# Altium schematic sheet NBIOT.SchDoc: TLS RASTRO - 01_MCU
size A2; DrawnBy: AP; Revision: 1.0; SheetNumber: 2; SheetTotal: 5
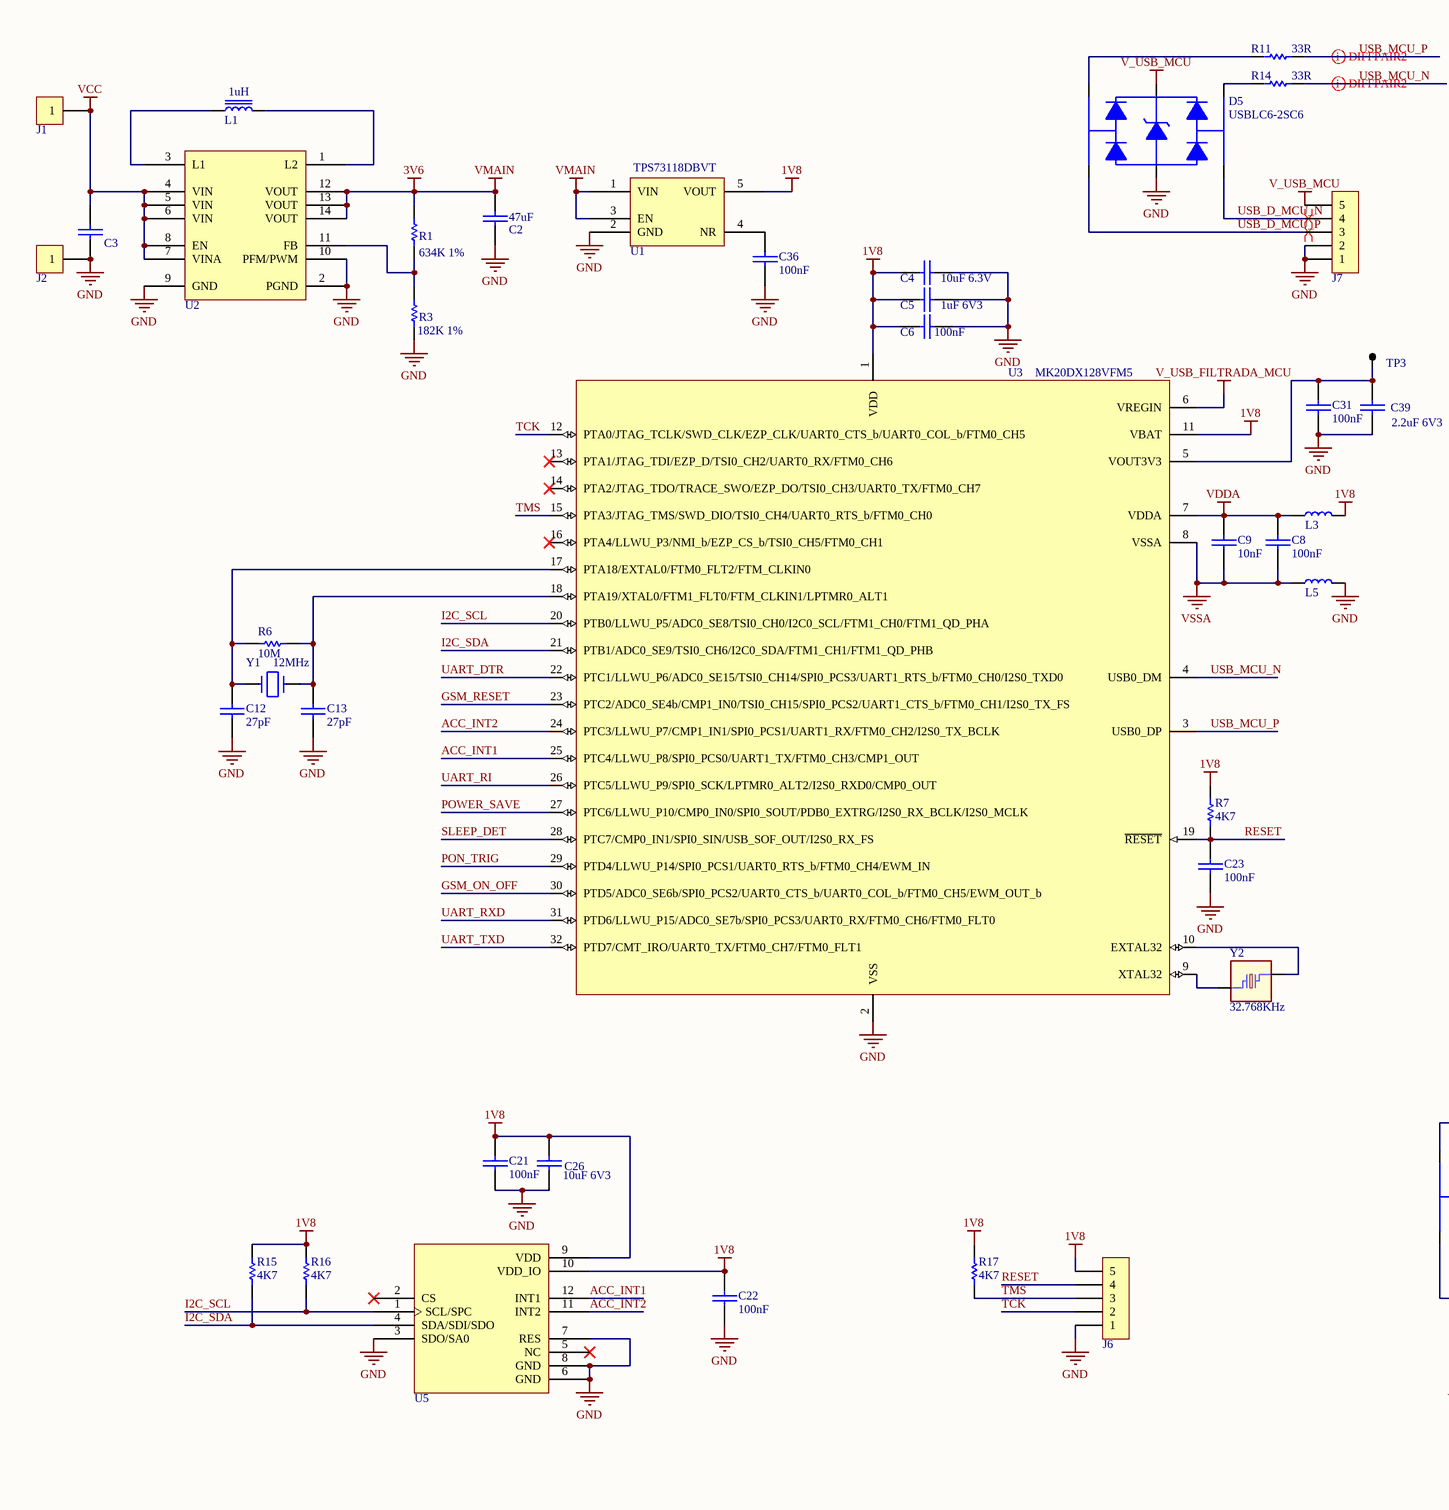
[diagram p0: NBIOT.SchDoc, left]
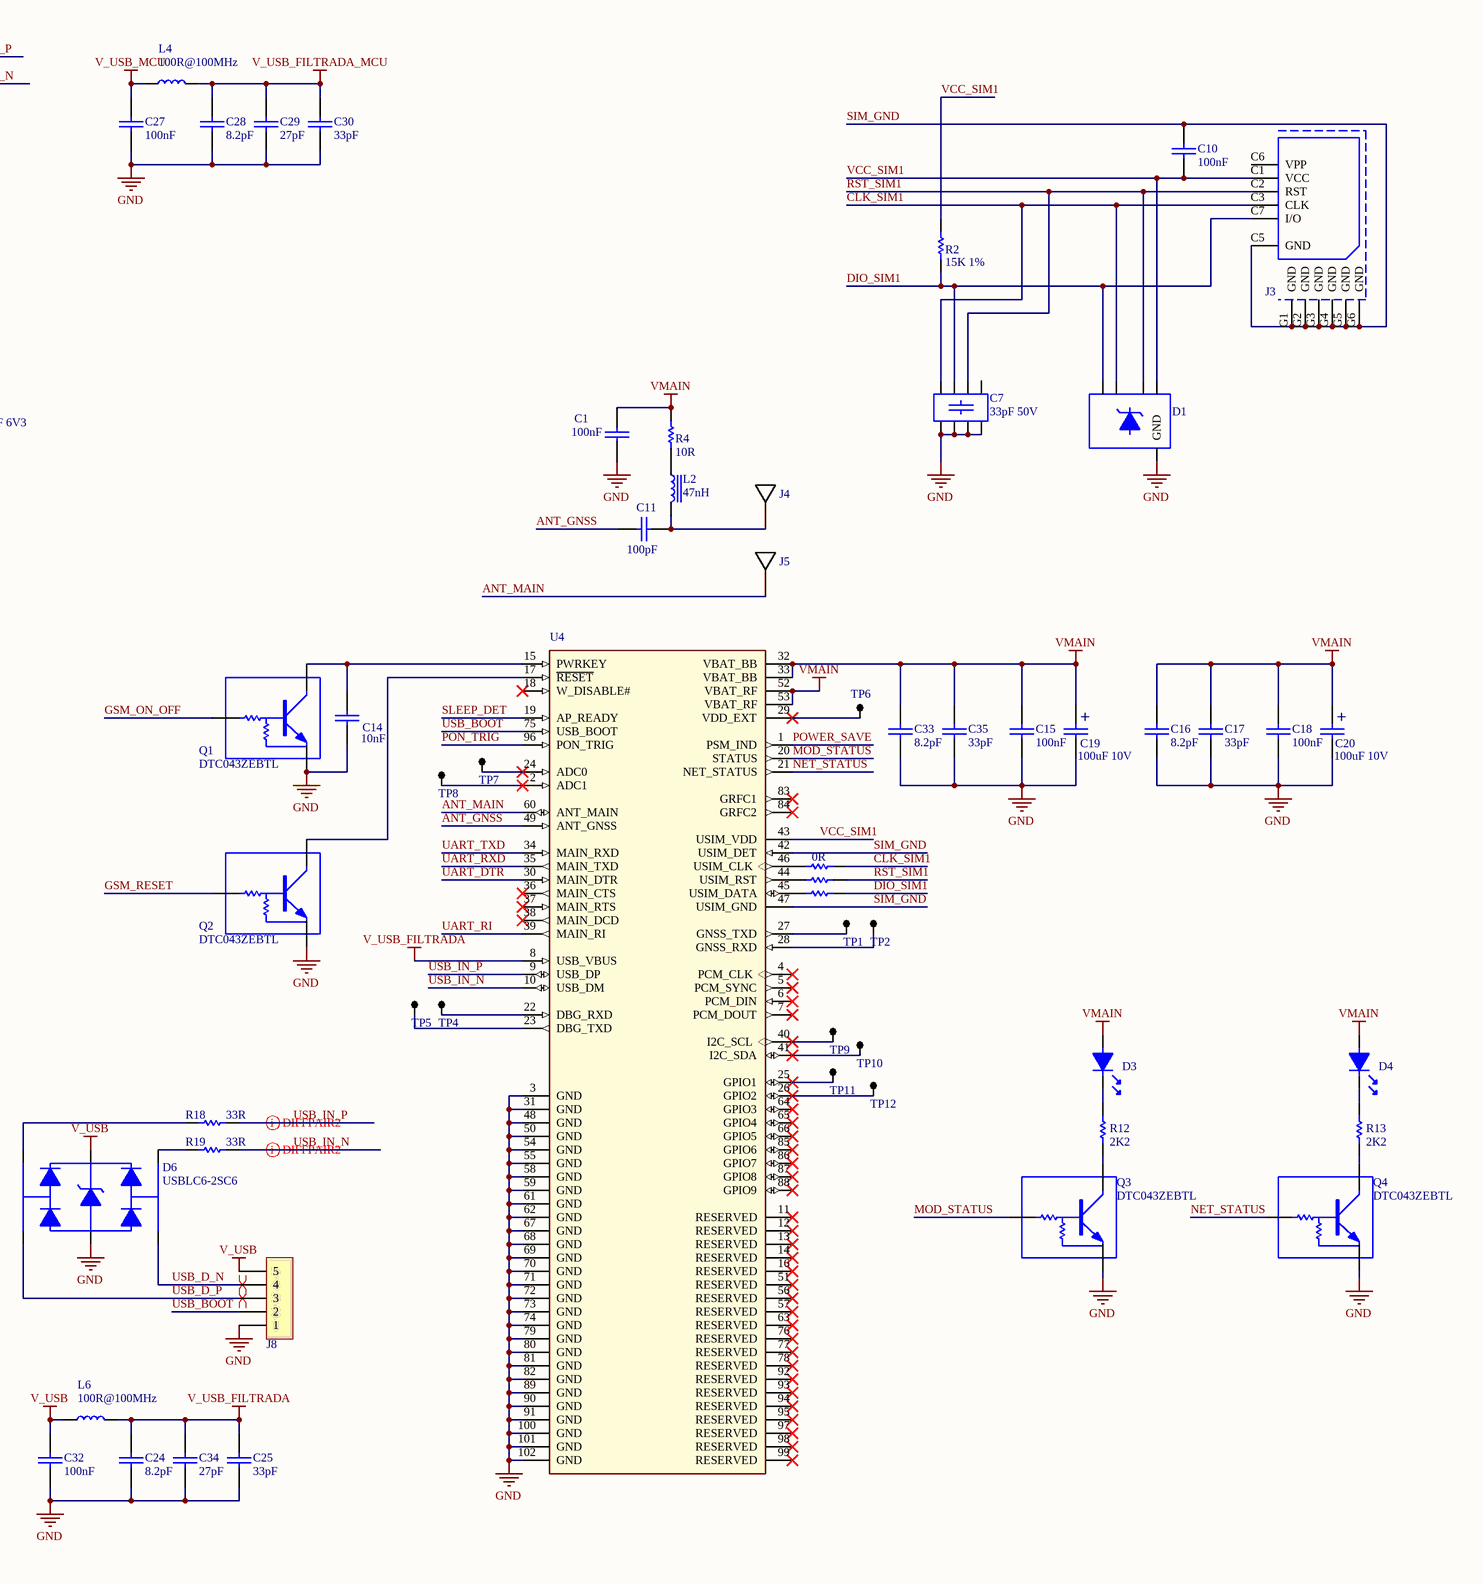
[diagram p1: NBIOT.SchDoc, right]

## Parts
C1  100nF  [0402]
C2  47uF  [0603]
C3  10uF 6V3  [0603]  (value not drawn)
C4  10uF 6.3V  [0603]
C5  1uF 6V3  [0402]
C6  100nF  [0402]
C7  33pF 50V  [CKCL44]
C8  100nF  [0402]
C9  10nF  [0402]
C10  100nF  [0402]
C11  100pF  [0402]
C12  27pF  [0402]
C13  27pF  [0402]
C14  10nF  [0402]
C15  100nF  [0402]
C16  8.2pF  [0402]
C17  33pF  [0402]
C18  100nF  [0402]
C19  100uF 10V  [1210P]
C20  100uF 10V  [1210P]
C21  100nF  [0402]
C22  100nF  [0402]
C23  100nF  [0402]
C24  8.2pF  [0402]
C25  33pF  [0402]
C26  10uF 6V3  [0603]
C27  100nF  [0402]
C28  8.2pF  [0402]
C29  27pF  [0402]
C30  33pF  [0402]
C31  100nF  [0402]
C32  100nF  [0402]
C33  8.2pF  [0402]
C34  27pF  [0402]
C35  33pF  [0402]
C36  100nF  [0402]
C39  2.2uF 6V3  [0402]
D1  SP1001-04  [SOT553]  (value not drawn)
D3  ROJO  [LED0805_R]  (value not drawn)
D4  ROJO  [LED0805_R]  (value not drawn)
D5  USBLC6-2SC6  [SOT23-6]
D6  USBLC6-2SC6  [SOT23-6]
J1  PIN CABLE  [PIN_CABLE]  (value not drawn)
J2  PIN CABLE  [PIN_CABLE]  (value not drawn)
J3  MOLEX 0786463001  [MOLEX_uSIM_0786463001]  (value not drawn)
J4  1566230-1  [Style A - 1566230]  (value not drawn)
J5  1566230-1  [Style A - 1566230]  (value not drawn)
J6  2111-1X5G00SB  [SIP5_MM]  (value not drawn)
J7  2111-1X5G00SB  [SIP5_MM]  (value not drawn)
J8  2111-1X5G00SB  [SIP5_MM]  (value not drawn)
L1  1uH  [XGL4020102]
L2  47nH  [0402]
L3  100R@100MHz  [0603]  (value not drawn)
L4  100R@100MHz  [0603]
L5  100R@100MHz  [0603]  (value not drawn)
L6  100R@100MHz  [0603]
Q1  DTC043ZEBTL  [SOT723]
Q2  DTC043ZEBTL  [SOT723]
Q3  DTC043ZEBTL  [SOT723]
Q4  DTC043ZEBTL  [SOT723]
R1  634K 1%  [0402]
R2  15K 1%  [0402]
R3  182K 1%  [0402]
R4  10R  [0402]
R6  10M  [0402]
R7  4K7  [0402]
R8  0R  [0402]
R9  0R  [0402]  (value not drawn)
R10  0R  [0402]  (value not drawn)
R11  33R  [0402]
R12  2K2  [0402]
R13  2K2  [0402]
R14  33R  [0402]
R15  4K7  [0402]
R16  4K7  [0402]
R17  4K7  [0402]
R18  33R  [0402]
R19  33R  [0402]
TP1  TP  [TP]  (value not drawn)
TP2  TP  [TP]  (value not drawn)
TP3  TP  [TP]  (value not drawn)
TP4  TP  [TP]  (value not drawn)
TP5  TP  [TP]  (value not drawn)
TP6  TP  [TP]  (value not drawn)
TP7  TP  [TP]  (value not drawn)
TP8  TP  [TP]  (value not drawn)
TP9  TP  [TP]  (value not drawn)
TP10  TP  [TP]  (value not drawn)
TP11  TP  [TP]  (value not drawn)
TP12  TP  [TP]  (value not drawn)
U1  TPS73118DBVT  [SOT23-5]
U2  TPS63025  [VQFN14]  (value not drawn)
U3  MK20DX128VFM5  [QFN32EP]
U4  BG95  [BG95]  (value not drawn)
U5  LIS2DS12  [LGA12]  (value not drawn)
Y1  12MHz  [NX3225SA]
Y2  32.768KHz  [ECS-1210]

## Nets
1V8: C4.1 C5.1 C6.1 C21.1 C22.1 C26.1 J6.5 L3.2 R7.2 R15.2 R16.2 R17.2 U1.5(VOUT) U3.1(VDD) U3.11(VBAT) U5.9(VDD) U5.10(VDD_IO)
3V6: C1.1 C2.1 C15.1 C16.1 C17.1 C18.1 C19.1 C20.1 C33.1 C35.1 D3.1 D4.1 R1.2 R4.2 U1.1(VIN) U1.3(EN) U2.12(VOUT) U2.13(VOUT) U2.14(VOUT) U4.32(VBAT_BB) U4.33(VBAT_BB) U4.52(VBAT_RF) U4.53(VBAT_RF)  [also labelled VMAIN]
GND: C1.2 C2.2 C3.2 C4.2 C5.2 C6.2 C7.1 C7.2 C7.3 C7.4 C12.2 C13.2 C14.2 C15.2 C16.2 C17.2 C18.2 C19.2 C20.2 C21.2 C22.2 C23.1 C24.2 C25.2 C26.2 C27.2 C28.2 C29.2 C30.2 C31.1 C32.2 C33.2 C34.2 C35.2 C36.1 C39.2 D1.2(GND) D5.2 D6.2 J2.1 J4.2 J4.3 J5.2 J5.3 J6.1 J7.1 J7.2 J8.1 L5.2 Q1.3(E) Q2.3(E) Q3.3(E) Q4.3(E) R3.1 U1.2(GND) U2.2(PGND) U2.9(GND) U2.10(PFM/PWM) U3.2(VSS) U4.3(GND) U4.31(GND) U4.48(GND) U4.50(GND) U4.54(GND) U4.55(GND) U4.58(GND) U4.59(GND) U4.61(GND) U4.62(GND) U4.67(GND) U4.68(GND) U4.69(GND) U4.70(GND) U4.71(GND) U4.72(GND) U4.73(GND) U4.74(GND) U4.79(GND) U4.80(GND) U4.81(GND) U4.82(GND) U4.89(GND) U4.90(GND) U4.91(GND) U4.100(GND) U4.101(GND) U4.102(GND) U5.3(SDO/SA0) U5.6(GND) U5.7(RES) U5.8(GND) Y1.2 Y1.4
V_USB: C32.1 D6.5 J8.5 L6.1
V_USB_FILTRADA: C24.1 C25.1 C34.1 L6.2 U4.8(USB_VBUS)
V_USB_FILTRADA_MCU: C28.1 C29.1 C30.1 L4.2 U3.6(VREGIN)
V_USB_MCU: C27.1 D5.5 J7.5 L4.1
VCC: C3.1 J1.1 U2.4(VIN) U2.5(VIN) U2.6(VIN) U2.7(VINA) U2.8(EN)
VDDA: C8.1 C9.1 L3.1 U3.7(VDDA)
VSSA: C8.2 C9.2 L5.1 U3.8(VSSA)
ACC_INT1: U3.25(PTC4/LLWU_P8/SPI0_PCS0/UART1_TX/FTM0_CH3/CMP1_OUT) U5.12(INT1)
ACC_INT2: U3.24(PTC3/LLWU_P7/CMP1_IN1/SPI0_PCS1/UART1_RX/FTM0_CH2/I2S0_TX_BCLK) U5.11(INT2)
ANT_GNSS: C11.1 U4.49(ANT_GNSS)
ANT_MAIN: J5.1 U4.60(ANT_MAIN)
CLK_SIM1: C7.5 D1.3 J3.C3(CLK) R8.2
DIO_SIM1: C7.6 D1.1 J3.C7(I/O) R2.1 R10.2
GSM_ON_OFF: Q1.1(B) U3.30(PTD5/ADC0_SE6b/SPI0_PCS2/UART0_CTS_b/UART0_COL_b/FTM0_CH5/EWM_OUT_b)
GSM_RESET: Q2.1(B) U3.23(PTC2/ADC0_SE4b/CMP1_IN0/TSI0_CH15/SPI0_PCS2/UART1_CTS_b/FTM0_CH1/I2S0_TX_FS)
I2C_SCL: R16.1 U3.20(PTB0/LLWU_P5/ADC0_SE8/TSI0_CH0/I2C0_SCL/FTM1_CH0/FTM1_QD_PHA) U5.1(SCL/SPC)
I2C_SDA: R15.1 U3.21(PTB1/ADC0_SE9/TSI0_CH6/I2C0_SDA/FTM1_CH1/FTM1_QD_PHB) U5.4(SDA/SDI/SDO)
MOD_STATUS: Q3.1(B) U4.20(STATUS)
NET_STATUS: Q4.1(B) U4.21(NET_STATUS)
PON_TRIG: U3.29(PTD4/LLWU_P14/SPI0_PCS1/UART0_RTS_b/FTM0_CH4/EWM_IN) U4.96(PON_TRIG)
POWER_SAVE: U3.27(PTC6/LLWU_P10/CMP0_IN0/SPI0_SOUT/PDB0_EXTRG/I2S0_RX_BCLK/I2S0_MCLK) U4.1(PSM_IND)
RESET: C23.2 J6.4 R7.1 U3.19(~{RESET})
RST_SIM1: C7.7 D1.4 J3.C2(RST) R9.2
SIM_GND: C10.1 J3.C5(GND) J3.G1(GND) J3.G2(GND) J3.G3(GND) J3.G4(GND) J3.G5(GND) J3.G6(GND) U4.42(USIM_DET) U4.47(USIM_GND)
SLEEP_DET: U3.28(PTC7/CMP0_IN1/SPI0_SIN/USB_SOF_OUT/I2S0_RX_FS) U4.19(AP_READY)
TCK: J6.2 U3.12(PTA0/JTAG_TCLK/SWD_CLK/EZP_CLK/UART0_CTS_b/UART0_COL_b/FTM0_CH5)
TMS: J6.3 R17.1 U3.15(PTA3/JTAG_TMS/SWD_DIO/TSI0_CH4/UART0_RTS_b/FTM0_CH0)
UART_DTR: U3.22(PTC1/LLWU_P6/ADC0_SE15/TSI0_CH14/SPI0_PCS3/UART1_RTS_b/FTM0_CH0/I2S0_TXD0) U4.30(MAIN_DTR)
UART_RI: U3.26(PTC5/LLWU_P9/SPI0_SCK/LPTMR0_ALT2/I2S0_RXD0/CMP0_OUT) U4.39(MAIN_RI)
UART_RXD: U3.31(PTD6/LLWU_P15/ADC0_SE7b/SPI0_PCS3/UART0_RX/FTM0_CH6/FTM0_FLT0) U4.35(MAIN_TXD)
UART_TXD: U3.32(PTD7/CMT_IRO/UART0_TX/FTM0_CH7/FTM0_FLT1) U4.34(MAIN_RXD)
USB_BOOT: J8.2 U4.75(USB_BOOT)
USB_D_MCU_N: D5.3 J7.4
USB_D_MCU_P: D5.1 J7.3
USB_D_N: D6.3 J8.4
USB_D_P: D6.1 J8.3
USB_IN_N: R19.2 U4.10(USB_DM)
USB_IN_P: R18.2 U4.9(USB_DP)
USB_MCU_N: R14.2 U3.4(USB0_DM)
USB_MCU_P: R11.2 U3.3(USB0_DP)
VCC_SIM1: C10.2 D1.5 J3.C1(VCC) R2.2 U4.43(USIM_VDD)
NetC11_2: C11.2 J4.1 L2.2
NetC12_1: C12.1 R6.1 U3.17(PTA18/EXTAL0/FTM0_FLT2/FTM_CLKIN0) Y1.1
NetC13_1: C13.1 R6.2 U3.18(PTA19/XTAL0/FTM1_FLT0/FTM_CLKIN1/LPTMR0_ALT1) Y1.3
NetC14_1: C14.1 Q1.2(C) U4.15(PWRKEY)
NetC31_2: C31.2 C39.1 TP3.1 U3.5(VOUT3V3)
NetC36_2: C36.2 U1.4(NR)
NetD3_2: D3.2 R12.2
NetD4_2: D4.2 R13.2
NetD5_4: D5.4 R14.1
NetD5_6: D5.6 R11.1
NetD6_4: D6.4 R19.1
NetD6_6: D6.6 R18.1
NetL1_1: L1.1 U2.3(L1)
NetL1_2: L1.2 U2.1(L2)
NetL2_1: L2.1 R4.1
NetQ2_2: Q2.2(C) U4.17(~{RESET})
NetQ3_2: Q3.2(C) R12.1
NetQ4_2: Q4.2(C) R13.1
NetR1_1: R1.1 R3.2 U2.11(FB)
NetR8_1: R8.1 U4.46(USIM_CLK)
NetR9_1: R9.1 U4.44(USIM_RST)
NetR10_1: R10.1 U4.45(USIM_DATA)
NetTP1_1: TP1.1 U4.27(GNSS_TXD)
NetTP2_1: TP2.1 U4.28(GNSS_RXD)
NetTP4_1: TP4.1 U4.22(DBG_RXD)
NetTP5_1: TP5.1 U4.23(DBG_TXD)
NetTP6_1: TP6.1 U4.29(VDD_EXT)
NetTP7_1: TP7.1 U4.24(ADC0)
NetTP8_1: TP8.1 U4.2(ADC1)
NetTP9_1: TP9.1 U4.40(I2C_SCL)
NetTP10_1: TP10.1 U4.41(I2C_SDA)
NetTP11_1: TP11.1 U4.25(GPIO1)
NetTP12_1: TP12.1 U4.26(GPIO2)
NetU3_9: U3.9(XTAL32) Y2.2
NetU3_10: U3.10(EXTAL32) Y2.1

Not connected (* = marked no-connect by the designer): C7 8; J3 C6(VPP); U3 13(PTA1/JTAG_TDI/EZP_D/TSI0_CH2/UART0_RX/FTM0_CH6)* 14(PTA2/JTAG_TDO/TRACE_SWO/EZP_DO/TSI0_CH3/UART0_TX/FTM0_CH7)* 16(PTA4/LLWU_P3/NMI_b/EZP_CS_b/TSI0_CH5/FTM0_CH1)*; U4 4(PCM_CLK)* 5(PCM_SYNC)* 6(PCM_DIN)* 7(PCM_DOUT)* 11(RESERVED)* 12(RESERVED)* 13(RESERVED)* 14(RESERVED)* 16(RESERVED)* 18(W_DISABLE#)* 36(MAIN_CTS)* 37(MAIN_RTS)* 38(MAIN_DCD)* 51(RESERVED)* 56(RESERVED)* 57(RESERVED)* 63(RESERVED)* 64(GPIO3)* 65(GPIO4)* 66(GPIO5)* 76(RESERVED)* 77(RESERVED)* 78(RESERVED)* 83(GRFC1)* 84(GRFC2)* 85(GPIO6)* 86(GPIO7)* 87(GPIO8)* 88(GPIO9)* 92(RESERVED)* 93(RESERVED)* 94(RESERVED)* 95(RESERVED)* 97(RESERVED)* 98(RESERVED)* 99(RESERVED)*; U5 2(CS)* 5(NC)*

## Layout directives
differential pair: USB_D_MCU_N, USB_D_MCU_P, USB_D_N, USB_D_P, USB_IN_N, USB_IN_P, USB_MCU_N, USB_MCU_P

## Notes on the sheet
- (in symbol CAP_TAN_100uF_10V_1210) +

## Library data of the parts
C1 = CAP0402_100nF_50V_X7R: CAP0402 100nF 50V X7R; Manufacturer: TDK Corporation; Manufacturer Part Number: C1005X7R1H104K050BB; CREO: LL; Part Number: CAP0402_100nF_50V_X7R; Value: 100nF; Supplier 1: Digi-Key; Supplier Part Number 1: 445-5932-2-ND
C2 = CAP0603_47uF_X5R: CAP0603 47uF 6.3V; Manufacturer: Murata Electronics; Manufacturer Part Number: GRM188R60J476ME15D; CREO: JP; Part Number: CAP0603_47uF_X5R; Value: 47uF; Supplier 1: Digi-Key; Supplier Part Number 1: 490-13247-1-ND
C3 C26 = CAP0603_10uF_6V3_X5R: CAP0603 10uF 6V3 X5R; Manufacturer: Murata Electronics; Manufacturer Part Number: GRM188R60J106KE47D; CREO: JP; Part Number: CAP0603_10uF_6V3_X5R; Value: 10uF 6V3; Supplier 1: Digi-Key; Supplier Part Number 1: 490-12538-1-ND
C4 = CAP0603_10uF_6.3V_Y5V: CAP0603 10uF 6.3V Y5V; Manufacturer: TDK Corporation; Manufacturer Part Number: C1608Y5V0J106Z; CREO: EB; Precio: 0; Part Number: CAP0603_10uF_6.3V_Y5V; Value: 10uF 6.3V; Digikey PN: 445-3448-1-ND; Supplier 1: Digi-Key; Supplier Part Number 1: 445-3448-1-ND
C5 = CAP0402_1uF_6V3_X5R: CAP0402 1uF 6V3 X5R; CREO: EB; Precio: 0; Part Number: CAP0402_1uF_6V3_X5R; Value: 1uF 6V3; Digikey PN: 445-4998-1-ND; Supplier 1: Digi-Key; Supplier Part Number 1: 445-4998-1-ND
C6 C8 C10 C15 C18 C21-C23 C31 C36 = CAP0402_100nF_50V_X7R: CAP0402 100nF 50V X7R; Manufacturer: TDK Corporation; Manufacturer Part Number: C1005X7R1H104K050BB; CREO: LL; Precio: 0; Part Number: CAP0402_100nF_50V_X7R; Value: 100nF; Digikey PN: 445-5932-2-ND; Supplier 1: Digi-Key; Supplier Part Number 1: 445-5932-2-ND
C7 = CAPARRAY0805_4_33pF_50V_NP0: CAP ARRAY 4CH 33PF 50V 0805; CREO: EB; Precio: 0; Part Number: CAPARRAY0805_4_33pF_50V_NP0; Value: 33pF 50V; Digikey PN: 445-1825-1-ND
C9 = CAP0402_10nF_X7R: CAP0402 10nF 50V X7R; Manufacturer: TDK Corporation; Manufacturer Part Number: C1005X7R1H103K050BB; CREO: EB; Precio: 0; Part Number: CAP0402_10nF_X7R; Value: 10nF; Digikey PN: 445-6850-2-ND; Supplier 1: Digi-Key; Supplier Part Number 1: 445-6850-2-ND
C11 = CAP0402_100pF_50V_5%_NP0: CAP0402 100PF 50V 5% NP0; CREO: EB; Part Number: CAP0402_100pF_50V_5%_NP0; Value: 100pF; Supplier 1: Digi-Key; Supplier Part Number 1: 445-8869-2-ND
C12 C13 C29 C34 = CAP0402_27pF_NP0: CAP0402 27pF 50V NP0; CREO: EB; Precio: 0; Part Number: CAP0402_27pF_NP0; Value: 27pF; Digikey PN: 311-1019-2-ND
  C12 C13: Supplier 1: Digi-Key; Supplier Part Number 1: 311-1019-2-ND
C14 = CAP0402_10nF_X7R: CAP0402 10nF 50V X7R; Manufacturer: TDK Corporation; Manufacturer Part Number: C1005X7R1H103K050BB; CREO: EB; Part Number: CAP0402_10nF_X7R; Value: 10nF; Supplier 1: Digi-Key; Supplier Part Number 1: 445-6850-2-ND
C16 C24 C28 C33 = CAP0402_8.2pF_NP0: CAP0402 8.2pF 50V NP0; CREO: EB; Precio: 0; Part Number: CAP0402_8.2pF_NP0; Value: 8.2pF; Digikey PN: 311-1012-2-ND
C17 C25 C30 C35 = CAP0402_33pF_NP0: CAP CER 33PF 50V 5% NP0 0402; Manufacturer: Murata; Manufacturer #: GRM1555C1H330JA01D; CREO: EB; Precio: 0; Part Number: CAP0402_33pF_NP0; Value: 33pF; Digikey PN: 490-5936-2-ND
C19 C20 = CAP_TAN_100uF_10V_1210: CAP TANT 100UF 10V 20% 1210; CREO: EB; Part Number: CAP_TAN_100uF_10V_1210; Value: 100uF 10V; Supplier 1: Digi-Key; Supplier Part Number 1: 718-1761-1-ND; APROBO: -
C27 C32 = CAP0402_100nF_50V_X7R: CAP0402 100nF 50V X7R; CREO: LL; Precio: 0; Part Number: CAP0402_100nF_50V_X7R; Value: 100nF; Digikey PN: 445-5932-2-ND
C39 = CAP0402_2.2uF_6V3_X5R: CAP0402 2.2uF 6V3 X5R; Manufacturer: TDK Corporation; Manufacturer Part Number: C1005X5R0J225M050BC; CREO: EB; Part Number: CAP0402_2.2uF_6V3_X5R; Value: 2.2uF 6V3; Supplier 1: Digi-Key; Supplier Part Number 1: 445-4999-2-ND
D1 = SP1001-04: TVS DIODE 5.5V 13V SOT553; Manufacturer: Littelfuse Inc.; Manufacturer Part Number: SP1001-04XTG; CREO: MM; Part Number: SP1001-04; Value: SP1001-04; Supplier 1: Digi-Key; Supplier Part Number 1: F2896CT-ND
D3 D4 = LED0805_ROJO_30MA: LED SUPER RED CLR THIN 0805 SMD; Manufacturer: Lite-On Inc; Manufacturer Part Number: LTST-C171KRKT; CREO: JS; Part Number: LED0805_ROJO_30MA; Value: ROJO; Supplier 1: Digi-Key; Supplier Part Number 1: 160-1427-2-ND
D5 D6 = USBLC6-2_SOT23-6: VERY LOW CAPACITANCE ESD 2 LINES PROTECTION; CREO: EB; Precio: 0; Part Number: USBLC6-2_SOT23-6; Value: USBLC6-2SC6; Digikey PN: 497-5235-2-ND
J1 J2 = PIN_1_CABLE_1mm: PIN PARA SOLDAR CABLE 1MM; Publico: EB; Part Number: PIN_1_CABLE_1mm; Value: PIN CABLE; Aprobo: -
J3 = MOLEX_uSIM_0786463001: 1.45mm Height Push-Pull micro-SIM Card Socket without Detect Switch; Publico: EB; Part Number: MOLEX_uSIM_0786463001; Value: MOLEX 0786463001; Supplier 1: Digi-Key; Supplier Part Number 1: WM9364TR-ND; Aprobo: -
J4 J5 = UMCC_1566230_A: CONN UMCC RCPT SMD STYLE A FOR TYPE-II/III; Publico: EB; Part Number: UMCC_1566230_A; Value: 1566230-1; Supplier 1: Digi-Key; Supplier Part Number 1: A36237CT-ND; Aprobo: -
J6 = HEADER_5POS_2MM: PIN HEADER 2.00mm 5POS; Manufacturer: Harwin; Manufacturer Part Number: M22-2510505; Publico: EB; Part Number: HEADER_5POS_2MM; Value: 2111-1X5G00SB; Supplier 1: Digi-Key; Supplier Part Number 1: 952-1314-ND; Aprobo: -
J7 J8 = HEADER_5POS_2MM: PIN HEADER 2.00mm 5POS; Publico: EB; Part Number: HEADER_5POS_2MM; Value: 2111-1X5G00SB; Supplier 1: OUPIIN; Aprobo: -
L1 = IND_PWR_1uH_DR: INDUCTOR SHIELD PWR 1UH SMD; Manufacturer: COILCRAFT; Manufacturer Part Number: XGL4020-102MEC; Publico: JP; Part Number: IND_PWR_1uH_DR; Value: 1uH; Supplier 1: Digi-Key; Supplier Part Number 1: 2457-XGL4020-102MEC-ND; Aprobo: -
L2 = IND0402_47nH: FIXED IND 47NH 440MA 648 MOHM; Manufacturer: Murata; Manufacturer Part Number: LQW15AN47NG80D; Publico: LB; Part Number: IND0402_47nH; Value: 47nH; Supplier 1: Digi-Key; Supplier Part Number 1: 490-7644-1-ND; Aprobo: -
L3 L5 = IND0603_100@100MHz: FERRITE CHIP 100 OHM 1A 0603; Publico: EB; Part Number: IND0603_100@100MHz; Value: 100R@100MHz; Supplier 1: Digi-Key; Supplier Part Number 1: 445-2988-1-ND; Aprobo: -
L4 L6 = IND0603_100_2A@100MHz: FERRITE CHIP 100 OHM 2A 0603; Manufacturer: Murata; Manufacturer #: BLM18EG101TN1D; Publico: EB; Precio: 0; Part Number: IND0603_100_2A@100MHz; Value: 100R@100MHz; Digikey PN: 490-5978-1-ND; Aprobo: -
Q1-Q4 = DTC043ZEBTL_SOT723: TRANS PREBIAS NPN 50V EMT3F; Manufacturer: Rohm Semiconductor; Publico: LB; Part Number: DTC043ZEBTL_SOT723; Value: DTC043ZEBTL; Manufacturer Part Number: DTC043ZEBTL; Supplier 1: Digi-Key; Supplier Part Number 1: DTC043ZEBTLCT-ND; Aprobo: -
R1 = RES0402_634K_1%: RES0402 634K 1%; Manufacturer: Stackpole Electronics Inc; Manufacturer Part Number: RMCF0402FT634K; Publico: JP; Part Number: RES0402_634K_1%; Value: 634K 1%; Supplier 1: Digi-Key; Supplier Part Number 1: RMCF0402FT634KCT-ND; Aprobo: -
R2 = RES0402_15K_1%: RES0402 15K 1%; Publico: EB; Part Number: RES0402_15K_1%; Value: 15K 1%; Supplier 1: Digi-Key; Supplier Part Number 1: RMCF0402FT15K0TR-ND; Aprobo: -
R3 = RES0402_182K_1%: RES0402 182K 1%; Publico: EB; Part Number: RES0402_182K_1%; Value: 182K 1%; Supplier 1: Digi-Key; Supplier Part Number 1: RMCF0402FT182K-ND; Aprobo: -
R4 = RES0402_10R_5%: RES0402 10R 5%; Publico: EB; Part Number: RES0402_10R_5%; Value: 10R; Supplier 1: Digi-Key; Supplier Part Number 1: RMCF0402JT10R0CT-ND; Aprobo: -
R6 = RES0402_10M_5%: RES0402 10M 5%; Publico: EB; Precio: 0; Part Number: RES0402_10M_5%; Value: 10M; Digikey PN: RMCF0402JT10M0CT-ND; Aprobo: -; Supplier 1: Digi-Key; Supplier Part Number 1: RMCF0402JT10M0CT-ND
R7 R15-R17 = RES0402_4K7_5%: RES0402 4K7 5%; Manufacturer: Stackpole Electronics Inc; Manufacturer Part Number: RMCF0402JT4K70; Publico: EB; Precio: 0; Part Number: RES0402_4K7_5%; Value: 4K7; Digikey PN: RMCF0402JT4K70CT-ND; Aprobo: -; Supplier 1: Digi-Key; Supplier Part Number 1: RMCF0402JT4K70CT-ND
R8-R10 = RES0402_0R: RES0402 0R; Manufacturer: Stackpole Electronics Inc; Manufacturer Part Number: RMCF0402ZT0R00; Publico: EB; Part Number: RES0402_0R; Value: 0R; Supplier 1: Digi-Key; Supplier Part Number 1: RMCF0402ZT0R00CT-ND; Aprobo: -
R11 R14 R18 R19 = RES0402_33R_5%: RES0402 33R 5%; Publico: EB; Precio: 0; Part Number: RES0402_33R_5%; Value: 33R; Digikey PN: RMCF0402JT33R0CT-ND; Aprobo: -
R12 R13 = RES0402_2K2_5%: RES0402 2K2 5%; Publico: EB; Part Number: RES0402_2K2_5%; Value: 2K2; Supplier 1: Digi-Key; Supplier Part Number 1: RMCF0402JT2K20CT-ND; Aprobo: -
TP1-TP12 = TP: Test Point; Publico: EB; Part Number: TP; Value: TP; Aprobo: -
U1 = TPS73118DBVT: IC REG LDO 1.8V .15A SOT23-5; Manufacturer: Texas Instruments; Publico: JP; Part Number: TPS73118DBVT; Value: TPS73118DBVT; Manufacturer Part Number: TPS73118DBVT; Supplier 1: Digi-Key; Supplier Part Number 1: 296-15802-1-ND; Aprobo: -
U2 = TPS630250RNCT: IC REG BCK BST ADJ 2A/4A 14VQFN; Manufacturer: Texas Instruments; Publico: JP; Part Number: TPS630250RNCT; Value: TPS63025; Manufacturer Part Number: TPS630250RNCT; Supplier 1: Digi-Key; Supplier Part Number 1: 296-42036-1-ND
U3 = MK20DX128VFM5: IC MCU 32BIT 128KB FLASH 32QFN; Manufacturer: NXP USA Inc.; Publico: AP; Part Number: MK20DX128VFM5; Value: MK20DX128VFM5; Manufacturer Part Number: MK20DX128VFM5; Supplier 1: Digi-Key; Supplier Part Number 1: MK20DX128VFM5-ND; Aprobo: -
U4 = BG95: LTE BG95 Cat M1/ Cat NB2/ EGPRS Module; Manufacturer: Quectel; Publico: MM; Check_prices: https://www.snapeda.com/parts/BG95/Quectel/view-part/4793187/?ref=eda; SnapEDA_Link: https://www.snapeda.com/parts/BG95/Quectel/view-part/4793187/?ref=snap; Value: BG95; Part Number: BG95; Aprobo: -
U5 = LIS2DS12: ACCEL 2-16G I2C/SPI 12LGA; Manufacturer: STMicroelectronics; Manufacturer Part Number: LIS2DS12TR; Publico: JP; Part Number: LIS2DS12; Value: LIS2DS12; Supplier 1: Digi-Key; Supplier Part Number 1: 497-16261-1-ND
Y1 = XTAL_12M_NX3225SA: CRYSTAL 12.0MHZ 8PF SMD; CREO: EB; Precio: 0; Part Number: XTAL_12M_NX3225SA; Value: 12MHz; Digikey PN: 644-1047-1-ND; APROBO: -; Supplier 1: Digi-Key; Supplier Part Number 1: 644-1047-1-ND
Y2 = XTAL_32768_XC2282CT: CRYSTAL 32.768KHZ 12.5PF SMD; Manufacturer: ECS Inc.; Manufacturer Part Number: ECS-.327-12.5-1210-TR; CREO: AP; Part Number: XTAL_32768_XC2282CT; Value: 32.768KHz; Supplier 1: Digi-Key; Supplier Part Number 1: XC2282CT-ND